# EAGLE design sticky-watch-v1.4 (EAGLE 7.6.0)
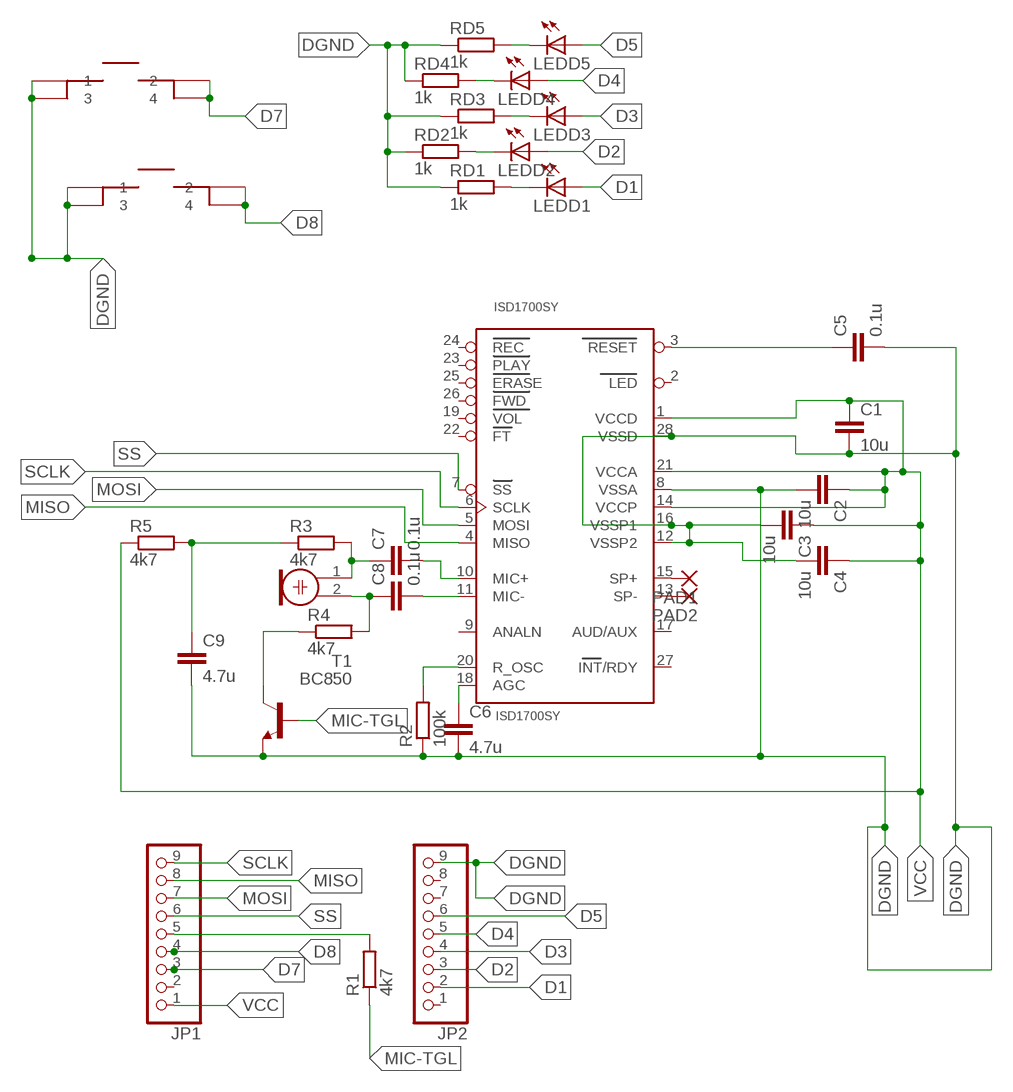
[diagram p0: schematic, sheet 1]

## Parts
C1  10u  C-EUC0603  [C0603]
C2  10u  C-EUC0603  [C0603]
C3  10u  C-EUC0603  [C0603]
C4  10u  C-EUC0603  [C0603]
C5  0.1u  C-EUC0603  [C0603]
C6  4.7u  C-EUC0603  [C0603]
C7  0.1u  C-EUC0603  [C0603]
C8  0.1u  C-EUC0603  [C0603]
C9  4.7u  C-EUC0603  [C0603]
ISD1700SY  ISD1700SY  [SO28W]
JP1  PINHD-1X9  [1X09]
JP2  PINHD-1X9  [1X09]
LEDD1  LEDSML0805  [SML0805]
LEDD2  LEDSML0805  [SML0805]
LEDD3  LEDSML0805  [SML0805]
LEDD4  LEDSML0805  [SML0805]
LEDD5  LEDSML0805  [SML0805]
M1  ELECTRET_MICROPHON-WM-63PR  [WM-63PR]
PAD1  1,6/0,8  [1,6/0,8]
PAD2  1,6/0,8  [1,6/0,8]
R1  4k7  R-EU_R0603  [R0603]
R2  100k  R-EU_R0603  [R0603]
R3  4k7  R-EU_R0603  [R0603]
R4  4k7  R-EU_R0603  [R0603]
R5  4k7  R-EU_R0603  [R0603]
RD1  1k  R-EU_R0603  [R0603]
RD2  1k  R-EU_R0603  [R0603]
RD3  1k  R-EU_R0603  [R0603]
RD4  1k  R-EU_R0603  [R0603]
RD5  1k  R-EU_R0603  [R0603]
S1  0  SMD-TACT  [SMD-TACT-5.2MM]
S2  SMD-TACT  [SMD-TACT-5.2MM]
T1  BC850  [SOT23]

## Nets
D1: JP2.2 LEDD1.A
D2: JP2.3 LEDD2.A
D3: JP2.4 LEDD3.A
D4: JP2.5 LEDD4.A
D5: JP2.6 LEDD5.A
D7: JP1.3 S2.2 S2.4
D8: JP1.4 S1.2 S1.4
DGND: C1.2 C2.2 C3.2 C4.2 C5.2 C6.2 C9.2 ISD1700SY.8(VSSA) ISD1700SY.12(VSSP2) ISD1700SY.16(VSSP1) ISD1700SY.28(VSSD) JP2.9 R2.1 RD1.1 RD2.1 RD3.1 RD4.1 RD5.1 S1.1 S1.3 S2.1 S2.3 T1.2(E)
MIC-TGL: R1.1 T1.1(B)
MISO: ISD1700SY.4(MISO) JP1.8
MOSI: ISD1700SY.5(MOSI) JP1.7
N$1: JP1.5 R1.2
N$2: R4.1 T1.3(C)
N$3: ISD1700SY.15(SP+) PAD1.1(P)
N$4: LEDD5.C RD5.2
N$5: C7.2 ISD1700SY.10(MIC+)
N$6: LEDD2.C RD2.2
N$7: LEDD3.C RD3.2
N$8: C5.1 ISD1700SY.3(RESET)
N$9: ISD1700SY.13(SP-) PAD2.1(P)
N$10: C6.1 ISD1700SY.18(AGC)
N$11: ISD1700SY.20(R_OSC) R2.2
N$12: LEDD4.C RD4.2
N$13: C8.2 ISD1700SY.11(MIC-)
N$14: C8.1 M1.2 R4.2
N$15: LEDD1.C RD1.2
N$16: C9.1 R3.1 R5.2
N$18: C7.1 M1.1 R3.2
SCLK: ISD1700SY.6(SCLK) JP1.9
SS: ISD1700SY.7(SS) JP1.6
VCC: C1.1 C2.1 C3.1 C4.1 ISD1700SY.1(VCCD) ISD1700SY.14(VCCP) ISD1700SY.21(VCCA) JP1.1 R5.1
Unconnected: ISD1700SY.2(LED) ISD1700SY.9(ANALN) ISD1700SY.17(AUD/AUX) ISD1700SY.19(VOL) ISD1700SY.22(FT) ISD1700SY.23(PLAY) ISD1700SY.24(REC) ISD1700SY.25(ERASE) ISD1700SY.26(FWD) ISD1700SY.27(INT/RDY) JP1.2 JP2.1 JP2.7 JP2.8

## Library data of the parts
C1-C9 = rcl:C-EU: CAPACITOR, European symbol
ISD1700SY = isd-new-1:ISD1700
JP1 JP2 = pinhead:PINHD-1X9: PIN HEADER
LEDD1-LEDD5 = led:LED: LED OSRAM: - CHIPLED LG R971, LG N971, LY N971, LG Q971, LY Q971, LO R971, LY R971 LH N974, LH R974 LS Q976, LO Q976, LY Q976 LO Q996 - Hyper CHIPLED LW Q18S LB Q993, LB Q99A, LB R99A - SideLED LS A670, LO A670, LY A670, LG A670, LP A670 LB A673, LV A673, LT A673, LW A673 LH A674 LY A675 LS A676, LA A676, LO A676, LY A676, LW A676 LS A679, LY A679, LG A679 - Hyper Micro SIDELED® LS Y876, LA Y876, LO Y876, LY Y876 LT Y87S - SmartLED LW L88C, LW L88S LB L89C, LB L89S, LG L890 LS L89K, LO L89K, LY L89K LS L896, LA L896, LO L896, LY L896 - TOPLED LS T670, LO T670, LY T670, LG T670, LP T670 LSG T670, LSP T670, LSY T670, LOP T670, LYG T670 LG T671, LOG T671, LSG T671 LB T673, LV T673, LT T673, LW T673 LH T674 LS T676, LA T676, LO T676, LY T676, LB T676, LH T676, LSB T676, LW T676 LB T67C, LV T67C, LT T67C, LS T67K, LO T67K, LY T67K, LW E67C LS E67B, LA E67B, LO E67B, LY E67B, LB E67C, LV E67C, LT E67C LW T67C LS T679, LY T679, LG T679 LS T770, LO T770, LY T770, LG T770, LP T770 LB T773, LV T773, LT T773, LW T773 LH T774 LS E675, LA E675, LY E675, LS T675 LS T776, LA T776, LO T776, LY T776, LB T776 LHGB T686 LT T68C, LB T68C - Hyper Mini TOPLED® LB M676 - Mini TOPLED Santana® LG M470 LS M47K, LO M47K, LY M47K Source: http://www.osram.convergy.de LUXEON: - LUMILED® LXK2-PW12-R00, LXK2-PW12-S00, LXK2-PW14-U00, LXK2-PW14-V00 LXK2-PM12-R00, LXK2-PM12-S00, LXK2-PM14-U00 LXK2-PE12-Q00, LXK2-PE12-R00, LXK2-PE12-S00, LXK2-PE14-T00, LXK2-PE14-U00 LXK2-PB12-K00, LXK2-PB12-L00, LXK2-PB12-M00, LXK2-PB14-N00, LXK2-PB14-P00, LXK2-PB14-Q00 LXK2-PR12-L00, LXK2-PR12-M00, LXK2-PR14-Q00, LXK2-PR14-R00 LXK2-PD12-Q00, LXK2-PD12-R00, LXK2-PD12-S00 LXK2-PH12-R00, LXK2-PH12-S00 LXK2-PL12-P00, LXK2-PL12-Q00, LXK2-PL12-R00 Source: www.luxeon.com KINGBRIGHT: KA-3528ASYC Source: www.kingbright.com
M1 = microphon:ELECTRET_MICROPHON-: Electret Condenser Microphone
PAD1 PAD2 = wirepad:1,6/0,8: THROUGH-HOLE PAD
R1-R5 RD1-RD5 = rcl:R-EU_: RESISTOR, European symbol
S1 S2 = proto-lab:SMD-TACT
T1 = transistor:BC850: NPN TRANSISTOR

## Board
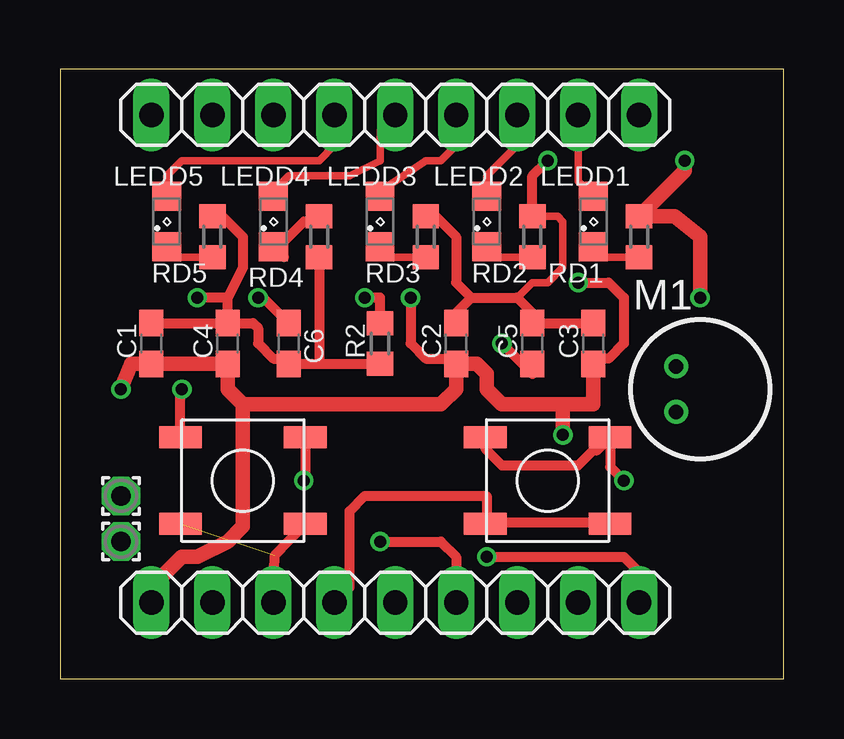
[diagram p1: board, top side]
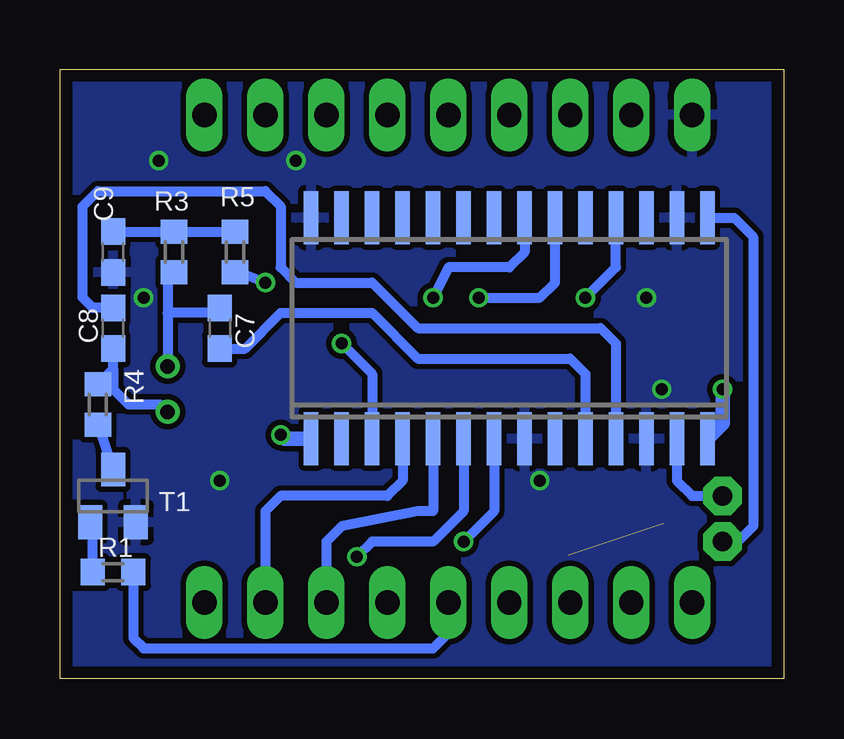
[diagram p2: board, bottom side, seen from below]

Size 30.15 x 25.39 mm. Coordinates in mm from the lower left corner, seen from the top.
Outline: 0,0 30.15,0 30.15,25.39 0,25.39 0,0
Copper layers (1*16): Top 0.035mm / dielectric 1.6mm / Bottom 0.035mm
Design rules "Elecrow_2-layer_PCB_eagle_rule": minimum track width 6mil, minimum drill 12mil, track to track 6mil, track to pad 6mil, pad to pad 6mil, via to via 8mil, smd to smd 0mil, copper to edge 20mil, drill to drill 10mil, minimum pad ring 6mil, minimum via ring 6mil, stop-mask expansion 0mil, vias tented up to drill 100mil, thermal gap 10mil

### Footprints (pad centres in the part's own frame; a part is rotated, then mirrored left to right if it is on the bottom)
C0603 = smd 1.1 x 1: 1 -0.85,0; 2 0.85,0
SO28W = smd 0.6 x 2.2: 1 -8.255,-4.6; 2 -6.985,-4.6; 3 -5.715,-4.6; 4 -4.445,-4.6; 5 -3.175,-4.6; 6 -1.905,-4.6; 7 -0.635,-4.6; 8 0.635,-4.6; 9 1.905,-4.6; 10 3.175,-4.6; 11 4.445,-4.6; 12 5.715,-4.6; 13 6.985,-4.6; 14 8.255,-4.6; 15 8.255,4.6; 16 6.985,4.6; 17 5.715,4.6; 18 4.445,4.6; 19 3.175,4.6; 20 1.905,4.6; 21 0.635,4.6; 22 -0.635,4.6; 23 -1.905,4.6; 24 -3.175,4.6; 25 -4.445,4.6; 26 -5.715,4.6; 27 -6.985,4.6; 28 -8.255,4.6
1X09 = drill 1.016 long: 1 -10.16,0; 2 -7.62,0; 3 -5.08,0; 4 -2.54,0; 5 0,0; 6 2.54,0; 7 5.08,0; 8 7.62,0; 9 10.16,0
SML0805 = smd 1.2 x 1.2: A 1.05,0; C -1.05,0
WM-63PR = drill 0.6 pad 1: 1 -1,0.95; 2 -1,-0.95
1,6/0,8 = drill 0.813 pad 1.6 octagon: 1 0,0
R0603 = smd 1 x 1.1: 1 -0.85,0; 2 0.85,0
SMD-TACT-5.2MM = smd 1.778 x 0.914: 1 -2.6,1.8; 2 -2.6,-1.8; 3 2.6,1.8; 4 2.6,-1.8
SOT23 = smd 1 x 1.4: 1 -0.95,-1.1; 2 0.95,-1.1; 3 0,1.1

### Placement (x,y rotation side)
C1  3.81,13.97 90 top
C2  16.51,13.97 90 top
C3  22.22,13.97 90 top
C4  6.98,13.97 90 top
C5  19.68,13.97 90 top
C6  9.53,13.97 270 top
C7  23.5,14.6 270 bottom
C8  27.94,14.6 90 bottom
C9  27.94,17.78 270 bottom
ISD1700SY  11.43,14.6 0 bottom
JP1  13.97,3.17 0 top
JP2  13.97,23.49 180 top
LEDD1  22.22,19.05 90 top
LEDD2  17.78,19.05 90 top
LEDD3  13.33,19.05 90 top
LEDD4  8.89,19.05 90 top
LEDD5  4.44,19.05 90 top
M1  26.67,12.06 0 top
PAD1  2.54,5.71 0 top
PAD2  2.54,7.62 0 top
R1  27.94,4.45 0 bottom
R2  13.33,13.97 90 top
R3  25.4,17.78 270 bottom
R4  28.57,11.43 90 bottom
R5  22.86,17.78 90 bottom
RD1  24.13,18.41 270 top
RD2  19.68,18.41 270 top
RD3  15.24,18.41 270 top
RD4  10.79,18.41 90 top
RD5  6.35,18.41 270 top
S1  20.32,8.25 0 top
S2  7.62,8.25 0 top
T1  27.94,7.62 0 bottom

### Tracks (layer width: path | path; a pad name or v marks a point on that pad's centre or on a via)
D1
  Top 0.305: LEDD1.A 21.59,20.73 JP2.2
D2
  Top 0.305: LEDD2.A 17.78,20.95 19.05,22.23 JP2.3
D3
  Top 0.305: LEDD3.A 13.33,20.32 15.24,21.59 15.87,21.59 16.51,22.23 JP2.4
D4
  Top 0.305: LEDD4.A 8.89,20.32 9.53,20.95 12.07,20.95 13.33,21.59 13.33,22.86 JP2.5
D5
  Top 0.305: LEDD5.A 4.44,20.95 5.08,21.59 10.79,21.59 11.43,22.23 JP2.6
D7  (1 unrouted)
  Top 0.406: JP1.3 8.95,5.14 S2.4
D8
  Top 0.406: JP1.4 12.07,3.81 12.07,6.98 12.7,7.62 17.78,7.62 17.78,6.52 | 17.78,6.52 S1.2 | 17.78,6.52 22.86,6.52 S1.4
DGND  (via drill 0.5, 0.5 pad 0.3)
  Top 0.305: RD2.1 20.74,19.27 20.96,19.05 20.96,17.14 20.32,16.51 19.68,16.51 19.05,15.88
  Top 0.406: v23.5,8.25 22.92,8.83 S1.3 22.39,9.52 22.22,9.52 21.59,8.89 18.41,8.89 17.72,9.59 S1.1 | C1.2 C4.2 | 10.79,13.12 C6.2 9.31,13.34 8.89,13.34 8.25,13.97 8.25,14.6 8.04,14.82 C4.2 | 10.79,13.12 R2.1 | C2.2 16.51,15.24 17.14,15.88 | 17.14,15.88 19.05,15.88 19.68,15.24 C5.2 C3.2 | RD4.1 10.79,13.12 | RD3.1 15.66,19.27 16.51,18.41 16.51,16.51 17.14,15.88 | RD5.1 6.77,19.27 7.62,18.41 7.62,17.14 6.98,15.88 | 6.98,15.88 v5.71,15.88 | C4.2 6.98,15.88 | S2.1 5.02,12 v5.08,12.06 | S2.3 10.22,8.31 v10.16,8.25 | RD2.1 19.68,20.95 v20.32,21.59
  Top 0.61: v26.67,15.88 26.67,18.41 25.61,19.27 RD1.1 26.04,21.17 v26.04,21.59
  Bottom 0.406: 26.99,6.66 T1.2
  pour Bottom (isolate 0.229): 0.63,0.63 0.63,24.77 29.84,24.77 29.84,0.63
MIC-TGL
  Bottom 0.406: R1.1 28.79,6.42 T1.1
MISO
  Bottom 0.406: ISD1700SY.4 15.87,8.25 16.51,7.62 20.96,7.62 21.59,6.98 JP1.8
MOSI
  Bottom 0.406: ISD1700SY.5 14.61,6.98 15.24,6.98 18.41,6.35 19.05,5.71 JP1.7
N$1
  Bottom 0.406: R1.2 27.09,1.69 26.67,1.27 14.61,1.27 13.97,1.91 JP1.5
N$2
  Bottom 0.406: T1.3 28.57,10.62 R4.1
N$3
  Bottom 0.406: ISD1700SY.15 2.06,19.2 1.27,18.41 1.27,6.35 1.9,5.71 PAD1.1
N$4
  Top 0.305: LEDD5.C 4.88,17.56 RD5.2
N$5
  Bottom 0.406: C7.2 22.44,13.75 20.96,15.24 17.14,15.24 15.24,13.34 8.89,13.34 8.25,12.7 ISD1700SY.10
N$6
  Top 0.305: RD2.2 18.21,17.56 LEDD2.C
N$7
  Top 0.305: RD3.2 13.77,17.56 LEDD3.C
N$8  (via drill 0.5)
  Top 0.406: C5.1 19.68,12.7 v18.41,13.97
  Bottom 0.406: v18.41,13.97 17.14,12.7 ISD1700SY.3
N$9
  Bottom 0.406: ISD1700SY.13 4.44,8.25 3.81,7.62 PAD2.1
N$10  (via drill 0.5)
  Top 0.406: v8.25,15.88 8.47,15.88 C6.1
  Bottom 0.406: v8.25,15.88 6.98,17.14 ISD1700SY.18
N$11  (via drill 0.5)
  Top 0.406: R2.2 13.33,15.88 v12.7,15.88
  Bottom 0.406: v12.7,15.88 10.16,15.88 9.53,16.51 ISD1700SY.20
N$12
  Top 0.305: 9.32,17.56 LEDD4.C
  Top 0.406: 9.32,17.56 9.32,18.21 10.16,19.05 10.58,19.05 RD4.2
N$13
  Bottom 0.406: C8.2 28.79,15.45 29.21,15.88 29.21,19.69 28.57,20.32 21.59,20.32 20.96,19.69 20.96,17.14 20.32,16.51 17.14,16.51 15.24,14.6 7.62,14.6 6.98,13.97 ISD1700SY.11
N$14
  Bottom 0.406: R4.2 27.94,12.91 | 27.94,12.91 C8.1 | 27.94,12.91 27.94,12.06 27.3,11.43 25.98,11.43 M1.2
N$15
  Top 0.305: RD1.2 22.66,17.56 LEDD1.C
N$16
  Bottom 0.406: C9.1 R3.1 R5.2
N$18
  Bottom 0.406: R3.2 25.67,16.66 25.67,15.24 | 25.67,15.24 M1.1 | C7.1 23.71,15.24 25.67,15.24
SCLK  (via drill 0.5)
  Top 0.406: v17.78,5.08 23.5,5.08 24.13,4.45 JP1.9
  Bottom 0.406: ISD1700SY.6 13.33,6.98 14.61,5.71 17.14,5.71 v17.78,5.08
SS  (via drill 0.5)
  Top 0.406: v13.33,5.71 15.87,5.71 16.51,5.08 JP1.6
  Bottom 0.406: ISD1700SY.7 12.07,6.98 v13.33,5.71
VCC  (via drill 0.5)
  Top 0.406: v14.61,15.88 14.61,13.97 15.24,13.34 16.29,13.34 C2.1 | v21.59,16.51 22.86,16.51 23.5,15.88 23.5,13.97 22.86,13.34 22.44,13.34 C3.1
  Top 0.61: 20.96,11.43 18.41,11.43 17.78,12.06 17.78,12.7 17.36,13.12 C2.1 16.51,12.06 15.87,11.43 7.62,11.43 | 20.96,11.43 22.22,11.43 C3.1 | v20.96,10.16 20.96,11.43 | v2.54,12.06 2.96,13.12 C1.1 C4.1 6.98,12.06 7.62,11.43 | JP1.1 3.81,3.81 5.08,5.08 5.71,5.08 6.98,5.71 7.62,6.35 7.62,11.43
  Bottom 0.406: ISD1700SY.21 10.79,17.78 11.43,17.14 13.97,17.14 v14.61,15.88 | R5.1 22.64,16.93 v21.59,16.51
  Bottom 0.61: ISD1700SY.1 20.8,10 v20.96,10.16 | ISD1700SY.14 2.54,10.64 v2.54,12.06